# EAGLE design BandaiLights (EAGLE 7.6.0)
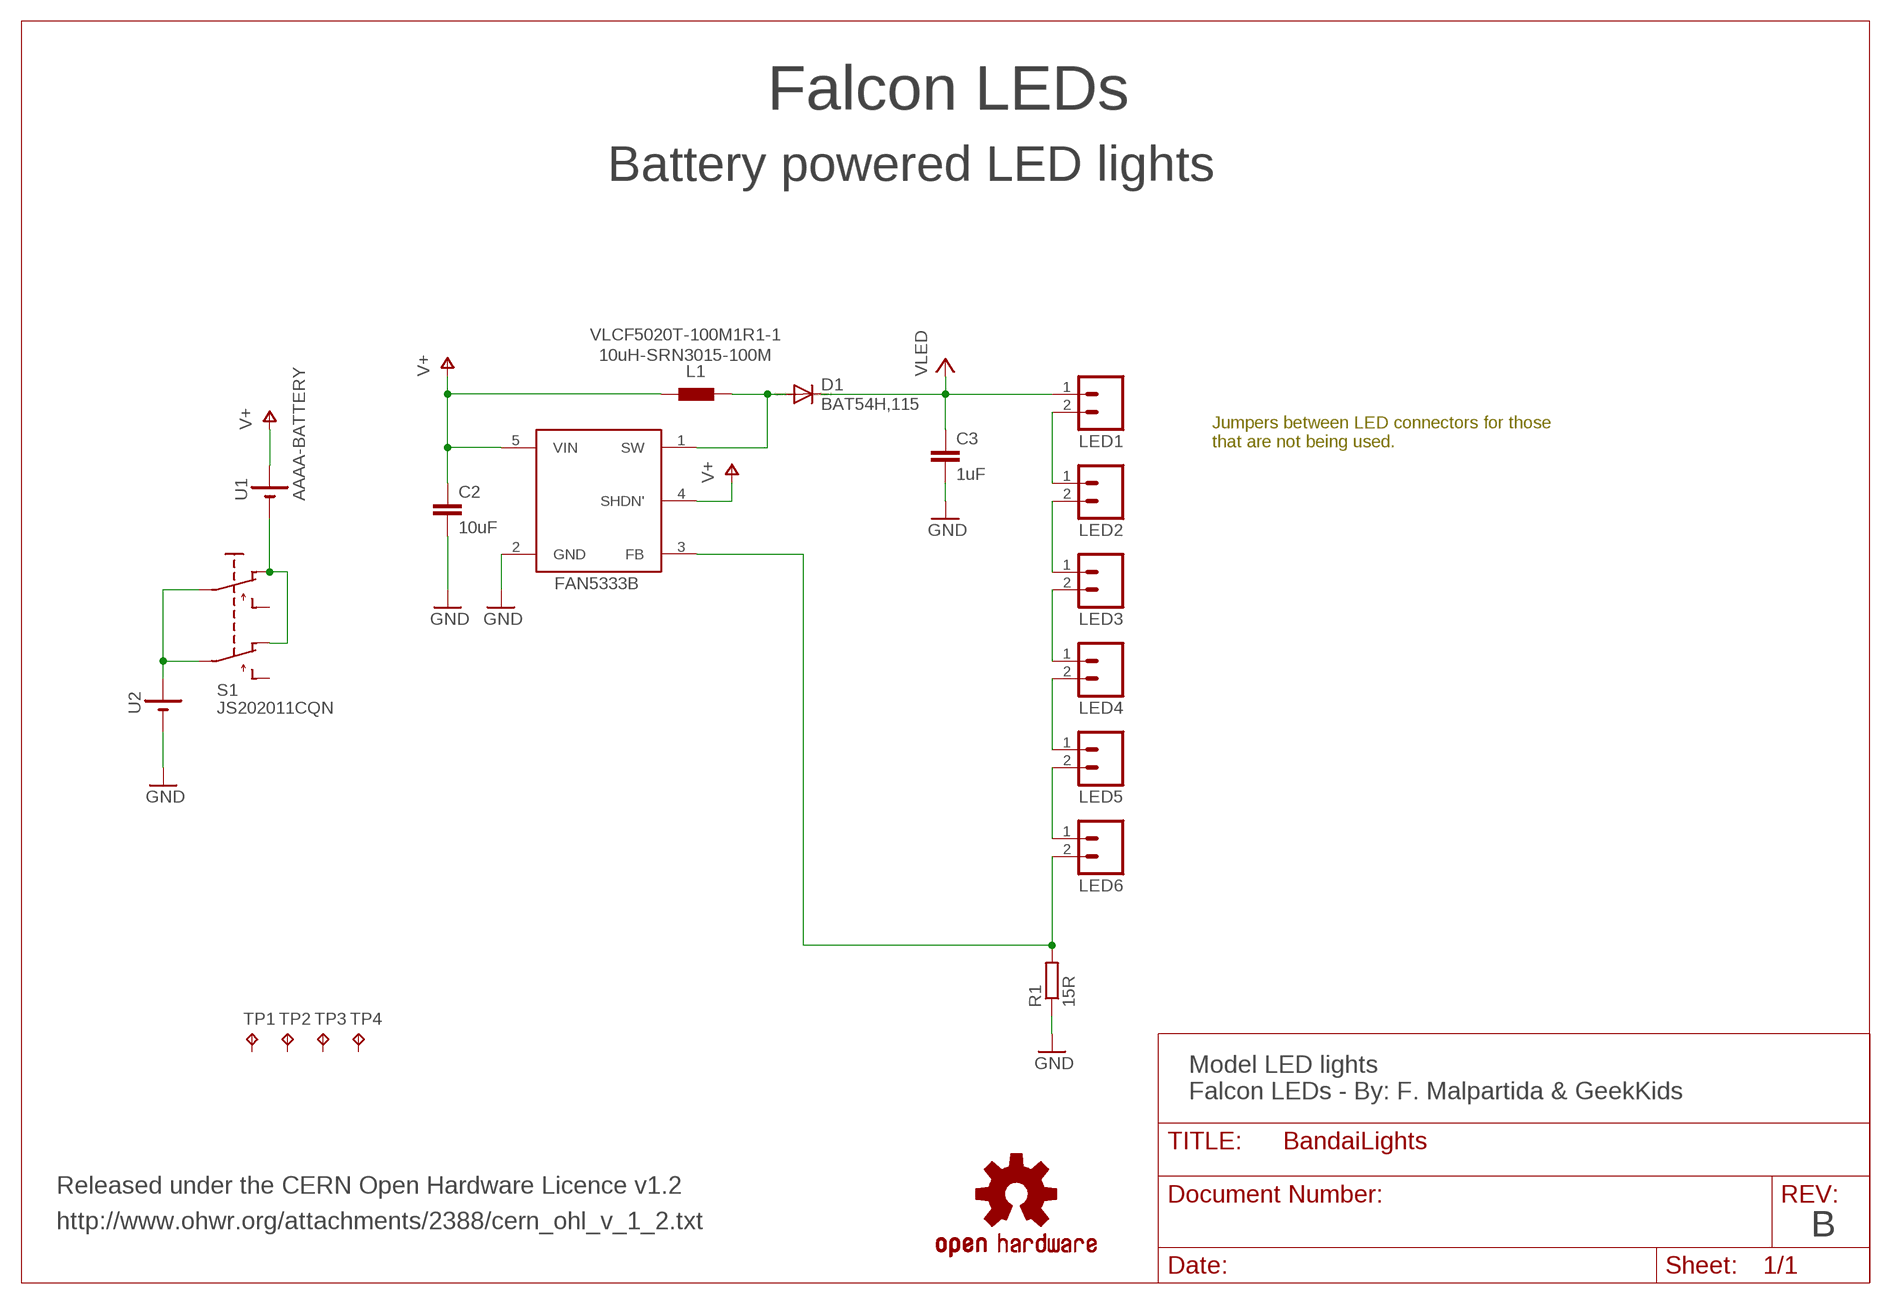
[diagram p0: schematic, sheet 1]

## Parts
C2  10uF  C-EUC1206  [C1206]
C3  1uF  C-EUC0805  [C0805]
D1  BAT54H,115  MBR0520LT  [SOD123]
L1  10uH-SRN3015-100M  LQHXXSNLQH55DN  [LQH]
LED1  M02PTH  [1X02]
LED2  M02PTH  [1X02]
LED3  M02PTH  [1X02]
LED4  M02PTH  [1X02]
LED5  M02PTH  [1X02]
LED6  M02PTH  [1X02]
Q1  FAN5333B  CAT4238  [SOT23-5]
R1  15R  R-EU_M0805  [M0805]
S1  JS202011CQN  MINI_SWITCH  [SWITCH-JS202011]
TP1  TPB1,27  [B1,27]
TP2  TPB1,27  [B1,27]
TP3  TPB1,27  [B1,27]
TP4  TPB1,27  [B1,27]
U1  AAAA-BATTERY  [51-AAAA]
U2  AAAA-BATTERY  [51-AAAA]
U$4  SPARKFUN_OSHW-LOGOM  [SPARKFUN_OSHW-LOGO-M]

## Nets
FB: LED6.2 Q1.3(FB) R1.2
GND: C2.2 C3.2 Q1.2(GND) R1.1 U2.P3(-) U2.P4(-)
N$1: LED1.2 LED2.1
N$2: LED2.2 LED3.1
N$3: LED3.2 LED4.1
N$4: LED4.2 LED5.1
N$5: D1.A L1.2 Q1.1(SW)
N$6: LED5.2 LED6.1
N$7: S1.P2(P) S1.P5(P1) U2.P1(+) U2.P2(+)
N$8: S1.P1(O) S1.P4(O1) U1.P3(-) U1.P4(-)
V+: C2.1 L1.1 Q1.4(SHDN') Q1.5(VIN) U1.P1(+) U1.P2(+)
VCC: C3.1 D1.C LED1.1 ; supply symbol labelled VLED
Unconnected: S1.P3(S) S1.P6(S1) TP1.TP TP2.TP TP3.TP TP4.TP

## Notes on the sheet
- Falcon LEDs
- Battery powered LED lights
- VLCF5020T-100M1R1-1
- Jumpers between LED connectors for those
  that are not being used.
- FAN5333B
- Model LED lights
  Falcon LEDs - By: F. Malpartida & GeekKids
- Released under the CERN Open Hardware Licence v1.2
- http://www.ohwr.org/attachments/2388/cern_ohl_v_1_2.txt
- B

## Library data of the parts
C2 C3 = rcl:C-EU: CAPACITOR, European symbol
D1 = diode:MBR0520LT: SCHOTTKY BARRIER RECTIFIER Source: http://onsemi.com .. MBR0520LT1-D.pdf
L1 = inductors:LQHXXSN
LED1-LED6 = SparkFun:M02: Header 2 Standard 2-pin 0.1" header. Use with straight break away headers (SKU : PRT-00116), right angle break away headers (PRT-00553), swiss pins (PRT-00743), machine pins (PRT-00117), and female headers (PRT-00115). Molex polarized connector foot print use with SKU : PRT-08233 with associated crimp pins and housings.
Q1 = fmc:CAT4238: CAT4238 High efficiency 10 LED boost converter- ON Semi.
R1 = resistor:R-EU_: RESISTOR, European symbol
S1 = fmc:MINI_SWITCH
TP1-TP4 = testpad:TP: Test pad
U1 U2 = fmc:AAAA-BATTERY
U$4 = SAVMakerI:SPARKFUN_OSHW-LOGO: Open Source Hardware Logo This logo indicates the piece of hardware it is found on incorporates a OSHW license and/or adheres to the definition of open source hardware found here: http://freedomdefined.org/OSHW

## Board
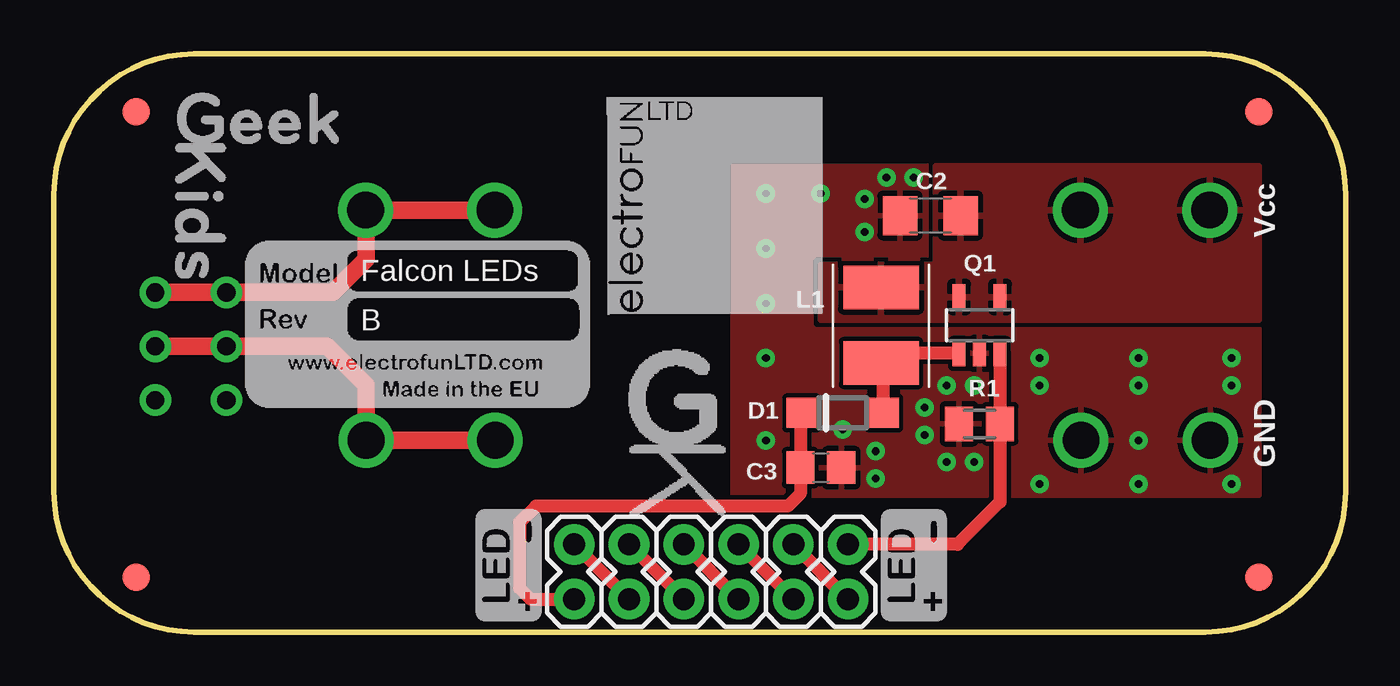
[diagram p1: board, top side]
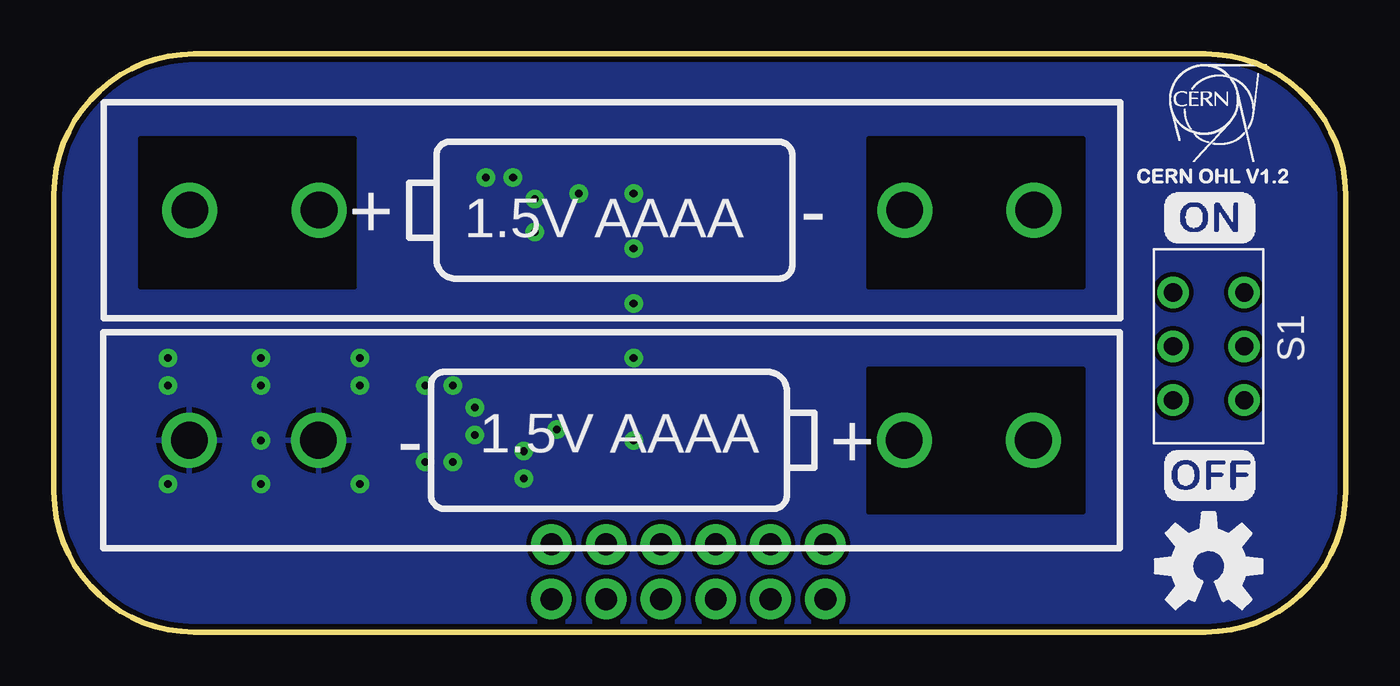
[diagram p2: board, bottom side, seen from below]

Size 59.9 x 26.8 mm. Coordinates in mm from the lower left corner, seen from the top.
Outline: 0,20.3 0,6.5 arc90 6.5,0 53.4,0 arc90 59.9,6.5 59.9,20.3 arc90 53.4,26.8 6.5,26.8 arc90 0,20.3
Copper layers (1*16): Top 0.035mm / dielectric 1.5mm / Bottom 0.035mm
Design rules "myDesignRules *": minimum track width 8mil, minimum drill 0.008890625mm, track to track 8mil, track to pad 8mil, pad to pad 8mil, via to via 8mil, smd to smd 8mil, copper to edge 10mil, drill to drill 8mil, minimum pad ring 12mil, minimum via ring 10mil, stop-mask expansion 4mil, vias tented up to drill 25mil, thermal gap 10mil
bRestrict: area 46,16 to 55.9,22.9; area 12.2,16 to 22.1,22.9; area 12.2,5.6 to 22.1,12.2

### Footprints (pad centres in the part's own frame; a part is rotated, then mirrored left to right if it is on the bottom)
C1206 = smd 1.6 x 1.8: 1 -1.4,0; 2 1.4,0
C0805 = smd 1.3 x 1.5: 1 -0.95,0; 2 0.95,0
SOD123 = smd 1.4 x 1.4: A 1.9,0; C -1.9,0
LQH = smd 2 x 3.5: 1 -1.75,0; 2 1.75,0
1X02 = drill 1.016 pad 1.88: 1 0,0; 2 2.54,0
SOT23-5 = smd 0.6 x 1.2: 1 -0.95,-1.306; 2 0,-1.306; 3 0.95,-1.306; 4 0.95,1.306; 5 -0.95,1.306
M0805 = smd 1.3 x 1.6: 1 -0.95,0; 2 0.95,0
SWITCH-JS202011 = drill 0.85: P1 0,-1.65; P2 2.5,-1.65; P3 5,-1.65; P4 0,1.65; P5 2.5,1.65; P6 5,1.65
B1,27 = smd 1.27 x 1.27: TP 0,0
51-AAAA = drill 1.7: P1 0,0; P2 -5.99,0; P3 -33.15,0; P4 -39.14,0

### Placement (x,y rotation side)
C2  40.64,19.3 180 top
C3  35.56,7.62 0 top
D1  36.58,10.16 0 top
L1  38.35,14.22 270 top
LED1  24.13,1.52 90 top
LED2  26.67,1.52 90 top
LED3  29.21,1.52 90 top
LED4  31.75,1.52 90 top
LED5  34.29,1.52 90 top
LED6  36.83,1.52 90 top
Q1  42.93,14.22 0 top
R1  42.93,9.65 0 top
S1  6.35,15.75 270 bottom
TP1  3.81,2.54 0 top
TP2  3.81,24.13 0 top
TP3  55.88,24.13 0 top
TP4  55.88,2.54 0 top
U1  53.59,19.56 180 bottom
U2  14.48,8.89 0 bottom
U$1  [CERN_OHL]  9.65,20.83 0 bottom
U$2  [ON]  8.38,18.03 0 bottom
U$3  [ELECTROFUN_10X10]  25.65,14.73 0 top
U$4  6.35,3.05 0 bottom
U$5  [BOARD_INFO_BMP_SMALL]  8.89,10.41 0 top
U$6  [OFF]  8.38,6.1 0 bottom
U$8  [LED_SILK]  22.61,0.51 90 top
U$9  [GEEKKIDS_S]  5.59,19.81 0 top
U$10  [GEEKKIDS_LOGO_S]  26.67,5.33 0 top
U$11  [LED_SILK]  41.4,0.51 90 top

### Tracks (layer width: path | path; a pad name or v marks a point on that pad's centre or on a via)
FB
  Top 0.61: Q1.3 R1.2 43.88,6.03 41.91,4.06 LED6.2
GND  (via drill 0.35)
  other vias: 42.67,11.43 41.4,11.43 41.4,7.87 40.39,10.41 40.39,9.14 38.1,8.38 38.1,7.11 36.58,9.4 37.59,18.54 37.59,20.07 38.61,21.08 39.88,21.08 42.67,7.87 45.72,12.7 50.29,12.7 33.02,12.7 54.61,12.7 54.61,11.43 33.02,15.24 50.29,11.43 45.72,11.43 33.02,17.78 33.02,20.32 45.72,6.86 50.29,6.86 35.56,20.32 54.61,6.86 50.29,8.89 33.02,8.89
  pour Bottom: 0,26.67 59.69,26.67 59.69,0 0,0
  pour Top (rank 2): 55.88,6.35 31.5,6.35 31.5,21.59 40.64,21.59 40.64,14.22 55.88,14.22
N$1
  Top 0.61: LED1.2 LED2.1
N$2
  Top 0.61: LED2.2 LED3.1
N$3
  Top 0.61: LED3.2 LED4.1
N$4
  Top 0.61: LED4.2 LED5.1
N$5
  Top 0.61: D1.A 38.48,12.35 L1.2 38.8,12.92 Q1.1
N$6
  Top 0.61: LED5.2 LED6.1
N$7
  Top 0.813: S1.P5 S1.P2 12.66,13.25 14.48,11.43 U2.P1 U2.P2
N$8
  Top 0.813: S1.P4 S1.P1 12.95,15.75 14.48,17.27 14.48,19.53 U1.P4 U1.P3
V+
  pour Top: 35.56,17.02 35.56,14.48 55.88,14.48 55.88,21.59 40.89,21.59 40.89,17.02
VCC
  Top 0.61: D1.C 34.61,10.41 C3.1 34.61,6.42 34.04,5.84 22.35,5.84 21.59,5.08 21.59,2.03 22.1,1.52 LED1.1

### Text on the board
tPlace: Vcc | Falcon LEDs | B | GND
Document: Falcon LEDs | Battery powered LED lights | Released under the CERN Open Hardware Licence v1.2 | http://www.ohwr.org/attachments/2388/cern_ohl_v_1_2.txt